# Altium project Float24.PrjPcb
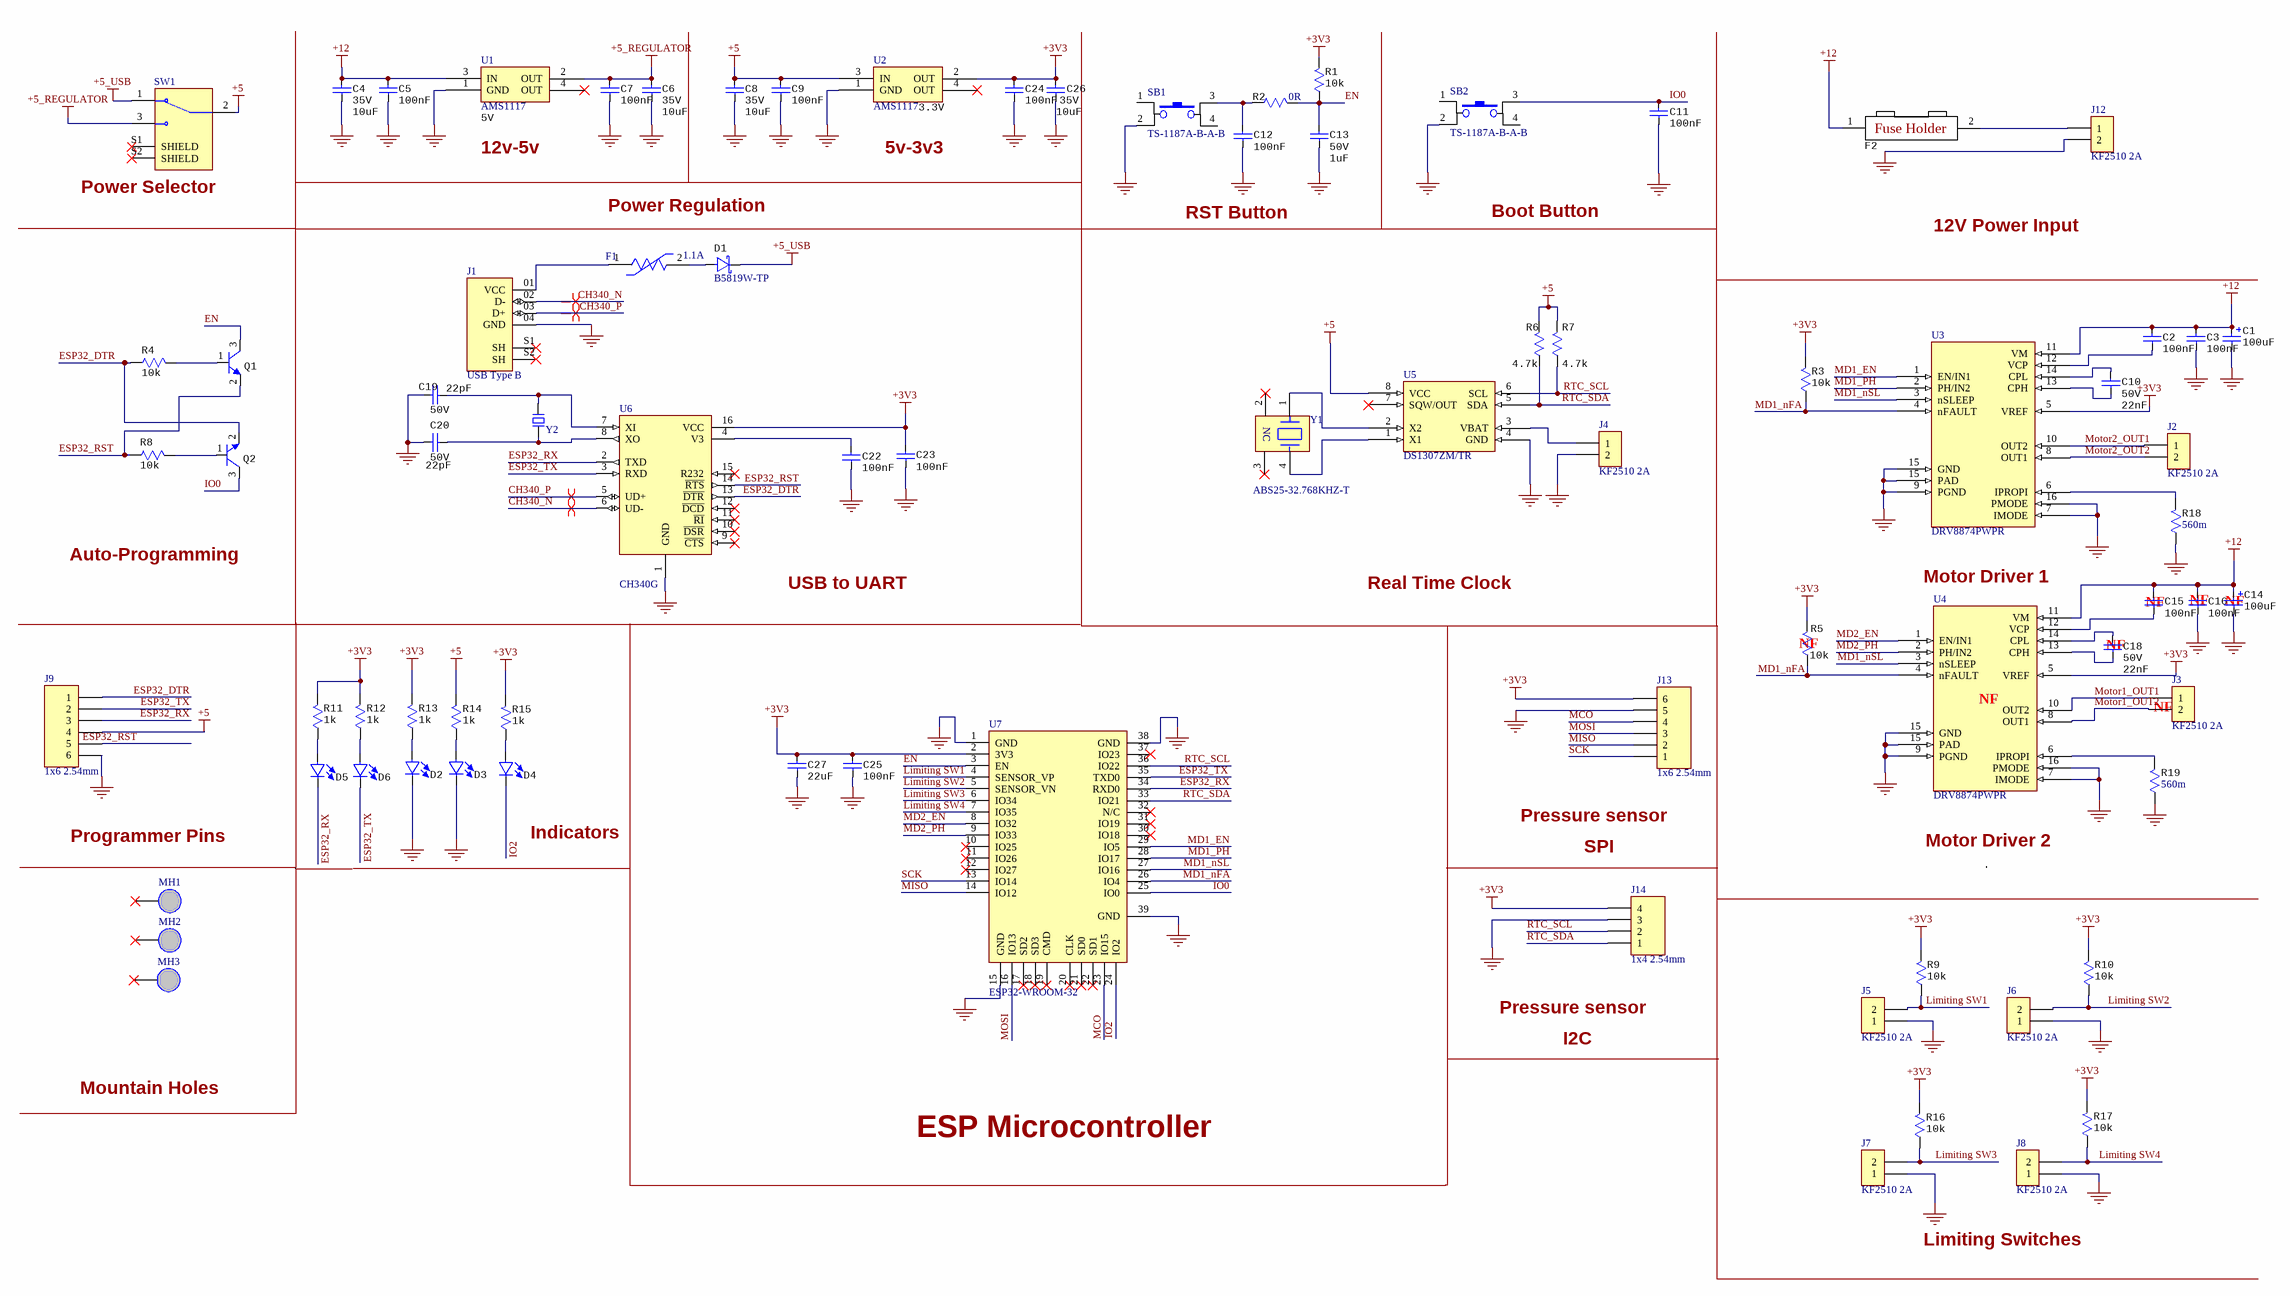
[diagram p0: Float24.SchDoc]
Title: Float24
1 sheet, 81 parts. Net scope: global (net labels, ports and power ports of the same name join across sheets).
Board file: Float24.PcbDoc

## Sheet Float24.SchDoc: Float24
size C; SheetNumber: 1; SheetTotal: 1

### Parts
C1  100uF  [CAP Electrolytic SMD G_10X10.3X10.2(CPOL-EU153CLV-1010)]
C2  100nF  [CAP Ceramic SMD 0603]
C3  100nF  [CAP Ceramic SMD 0603]
C4  Voltage: 35V  [CAP Ceramic SMD 0603]  (hidden comment: 10uF)
C5  100nF  [CAP Ceramic SMD 0603]
C6  Voltage: 35V  [CAP Ceramic SMD 0603]  (hidden comment: 10uF)
C7  100nF  [CAP Ceramic SMD 0603]
C8  Voltage: 35V  [CAP Ceramic SMD 0603]  (hidden comment: 10uF)
C9  100nF  [CAP Ceramic SMD 0603]
C10  Voltage: 50V  [CAP Ceramic SMD 0603]  (hidden comment: 22nF)
C11  100nF  [CAP Ceramic SMD 0603]
C12  100nF  [CAP Ceramic SMD 0603]
C13  Voltage: 50V  [CAP Ceramic SMD 0603]  (hidden comment: 1uF)
C14  100uF  [CAP Electrolytic SMD G_10X10.3X10.2(CPOL-EU153CLV-1010)]
C15  100nF  [CAP Ceramic SMD 0603]
C16  100nF  [CAP Ceramic SMD 0603]
C18  Voltage: 50V  [CAP Ceramic SMD 0603]  (hidden comment: 22nF)
C19  Voltage: 50V  [CAP Ceramic SMD 0603]  (hidden comment: 22pF)
C20  Voltage: 50V  [CAP Ceramic SMD 0603]  (hidden comment: 22pF)
C22  100nF  [CAP Ceramic SMD 0603]
C23  100nF  [CAP Ceramic SMD 0603]
C24  100nF  [CAP Ceramic SMD 0603]
C25  100nF  [CAP Ceramic SMD 0603]
C26  Voltage: 35V  [CAP Ceramic SMD 0603]  (hidden comment: 10uF)
C27  22uF  [CAP Ceramic SMD 0603]
D1  Manufacturer Part Number: B5819W-TP  [Diode Single SMD SOD123]
D2  (no value)  [LED SMD 0805G]
D3  (no value)  [LED SMD 0805G]
D4  (no value)  [LED SMD 0805R]
D5  (no value)  [LED SMD 0805B]
D6  (no value)  [LED SMD 0805B]
F1  Hold Current: 1.1A  [FUSE-1206]  (hidden comment: 1206L110THYR)
F2  XF-508P-A  [FUSE-TH_L19.8-W7.0_XF-508P-A]  (value not drawn)
J1  USB Type B  [USB_B_Vertical]
J2  KF2510 2A  [Connector MOLEX KK-254 KF2510-2]
J3  KF2510 2A  [Connector MOLEX KK-254 KF2510-2]
J4  KF2510 2A  [Connector MOLEX KK-254 KF2510-2]
J5  KF2510 2A  [Connector MOLEX KK-254 KF2510-2]
J6  KF2510 2A  [Connector MOLEX KK-254 KF2510-2]
J7  KF2510 2A  [Connector MOLEX KK-254 KF2510-2]
J8  KF2510 2A  [Connector MOLEX KK-254 KF2510-2]
J9  1x6 2.54mm  [Header F 2.54X6]
J12  KF2510 2A  [Connector MOLEX KK-254 KF2510-2]
J13  1x6 2.54mm  [Header F 2.54X6]
J14  1x4 2.54mm  [Header F 2.54X4]
MH1  Mounting Hole 4mm  [Connector Mounting hole TH 4mm]  (value not drawn)  (no BOM)
MH2  Mounting Hole 4mm  [Connector Mounting hole TH 4mm]  (value not drawn)  (no BOM)
MH3  Mounting Hole 4mm  [Connector Mounting hole TH 4mm]  (value not drawn)  (no BOM)
Q1  (no value)  [SOT23]
Q2  (no value)  [SOT23]
R1  value 10k  [RES SMD 0603]  (hidden comment: 10kR)
R2  0R  [RES SMD 0603]
R3  value 10k  [RES SMD 0603]  (hidden comment: 10kR)
R4  value 10k  [RES SMD 0603]  (hidden comment: 10kR)
R5  value 10k  [RES SMD 0603]  (hidden comment: 10kR)
R6  value 4.7k  [RES SMD 0603]  (hidden comment: 4.7kR)
R7  value 4.7k  [RES SMD 0603]  (hidden comment: 4.7kR)
R8  value 10k  [RES SMD 0603]  (hidden comment: 10kR)
R9  value 10k  [RES SMD 0603]  (hidden comment: 10kR)
R10  value 10k  [RES SMD 0603]  (hidden comment: 10kR)
R11  value 1k  [RES SMD 0603]  (hidden comment: 1kR)
R12  value 1k  [RES SMD 0603]  (hidden comment: 1kR)
R13  value 1k  [RES SMD 0603]  (hidden comment: 1kR)
R14  value 1k  [RES SMD 0603]  (hidden comment: 1kR)
R15  value 1k  [RES SMD 0603]  (hidden comment: 1kR)
R16  value 10k  [RES SMD 0603]  (hidden comment: 10kR)
R17  value 10k  [RES SMD 0603]  (hidden comment: 10kR)
R18  560m  [RES SMD 0603]
R19  560m  [RES SMD 0603]
SB1  TS-1187A-B-A-B  [SW-SMD-4X4X1.5]
SB2  TS-1187A-B-A-B  [SW-SMD-4X4X1.5]
SW1  (no value)  [SS12 Slide Switch]
U1  AMS1117  Voltage output: 5V  [Linear reagulator SMD AMS1117 - duplicate]
U2  AMS1117  Voltage output: 3.3V  [Linear reagulator SMD AMS1117 - duplicate]
U3  DRV8874PWPR  [DRV8874PWPR]
U4  DRV8874PWPR  [DRV8874PWPR]
U5  DS1307ZM/TR  [SOP-8]
U6  CH340G  [SOIC127P600X180-16N]
U7  ESP32-WROOM-32  [ESP32-WROOM-32D]
Y1  ABS25-32.768KHZ-T  [Crystal SMD 4-PIN MC-306]
Y2  X49SD12MSD2SC  [Crystal TH 2-PIN HC-49S]  (value not drawn)

### Nets
+3V3: C23.1 C24.1 C25.1 C26.1 C27.1 J13.6 J14.4 R1.2 R3.2 R5.2 R9.2 R10.2 R11.2 R12.2 R13.2 R15.2 R16.2 R17.2 U2.2(OUT) U3.5(VREF) U4.5(VREF) U6.16(VCC) U7.2(3V3)
+5: C8.1 C9.1 J9.4 R6.2 R7.2 R14.2 SW1.2(COM_2) U2.3(IN) U5.8(VCC)
+5_REGULATOR: C6.1 C7.1 SW1.3 U1.2(OUT)
+5_USB: D1.2 SW1.1
+12: C1.1 C2.1 C3.1 C4.1 C5.1 C14.1 C15.1 C16.1 F2.1 U1.3(IN) U3.11(VM) U4.11(VM)
GND: C1.2 C3.2 C4.2 C5.2 C6.2 C7.2 C8.2 C9.2 C11.2 C12.2 C13.2 C14.2 C16.2 C19.1 C20.1 C22.2 C23.2 C24.2 C25.2 C26.2 C27.2 D2.2 D3.2 J1.04(GND) J4.2 J5.1 J6.1 J7.1 J8.1 J9.6 J12.2 J13.5 J14.3 R18.1 R19.1 SB1.2 SB2.2 U1.1(GND) U2.1(GND) U3.7(IMODE) U3.9(PGND) U3.15(GND) U3.16(PMODE) U4.7(IMODE) U4.9(PGND) U4.15(GND) U4.16(PMODE) U5.4(GND) U6.1(GND) U7.1(GND) U7.15(GND) U7.38(GND) U7.39(GND)
CH340_N: J1.02(D-) U6.6(UD-)
CH340_P: J1.03(D+) U6.5(UD+)
EN: C13.1 Q1.3(C) R1.1 R2.2 U7.3(EN)
ESP32_DTR: J9.1 Q2.2(E) R4.1 U6.13(~{DTR})
ESP32_RST: J9.5 Q1.2(E) R8.1 U6.14(~{RTS})
ESP32_RX: D5.2 J9.3 U6.2(TXD) U7.34(RXD0)
ESP32_TX: D6.2 J9.2 U6.3(RXD) U7.35(TXD0)
IO0: C11.1 Q2.3(C) SB2.3 U7.25(IO0)
IO2: D4.2 U7.24(IO2)
Limiting SW1: J5.2 R9.1 U7.4(SENSOR_VP)
Limiting SW2: J6.2 R10.1 U7.5(SENSOR_VN)
Limiting SW3: J7.2 R16.1 U7.6(IO34)
Limiting SW4: J8.2 R17.1 U7.7(IO35)
MCO: J13.4 U7.23(IO15)
MD1_EN: U3.1(EN/IN1) U7.29(IO5)
MD1_nFA: R3.1 R5.1 U3.4(nFAULT) U4.4(nFAULT) U7.26(IO4)
MD1_nSL: U3.3(nSLEEP) U4.3(nSLEEP) U7.27(IO16)
MD1_PH: U3.2(PH/IN2) U7.28(IO17)
MD2_EN: U4.1(EN/IN1) U7.8(IO32)
MD2_PH: U4.2(PH/IN2) U7.9(IO33)
MISO: J13.2 U7.14(IO12)
MOSI: J13.3 U7.16(IO13)
Motor1_OUT1: J3.1 U4.10(OUT2)
Motor1_OUT2: J3.2 U4.8(OUT1)
Motor2_OUT1: J2.1 U3.10(OUT2)
Motor2_OUT2: J2.2 U3.8(OUT1)
RTC_SCL: J14.2 R7.1 U5.6(SCL) U7.36(IO22)
RTC_SDA: J14.1 R6.1 U5.5(SDA) U7.33(IO21)
SCK: J13.1 U7.13(IO14)
NetC2_2: C2.2 U3.12(VCP)
NetC10_1: C10.1 U3.14(CPL)
NetC10_2: C10.2 U3.13(CPH)
NetC12_1: C12.1 R2.1 SB1.3
NetC15_2: C15.2 U4.12(VCP)
NetC18_1: C18.1 U4.14(CPL)
NetC18_2: C18.2 U4.13(CPH)
NetC19_2: C19.2 U6.7(XI) Y2.1
NetC20_2: C20.2 U6.8(XO) Y2.2
NetC22_1: C22.1 U6.4(V3)
NetD1_1: D1.1 F1.2
NetD2_1: D2.1 R13.1
NetD3_1: D3.1 R14.1
NetD4_1: D4.1 R15.1
NetD5_1: D5.1 R11.1
NetD6_1: D6.1 R12.1
NetF1_1: F1.1 J1.01(VCC)
NetF2_2: F2.2 J12.1
NetJ4_1: J4.1 U5.3(VBAT)
NetQ1_1: Q1.1(B) R4.2
NetQ2_1: Q2.1(B) R8.2
NetR18_2: R18.2 U3.6(IPROPI)
NetR19_2: R19.2 U4.6(IPROPI)
NetU5_1: U5.1(X1) Y1.4
NetU5_2: U5.2(X2) Y1.1

Not connected (* = marked no-connect by the designer): J1 S1(SH)* S2(SH)*; MH1 1*; MH2 1*; MH3 1*; SB1 1 4; SB2 1 4; SW1 S1(SHIELD)* S2(SHIELD)*; U1 4(OUT)*; U2 4(OUT)*; U5 7(SQW/OUT)*; U6 9(~{CTS})* 10(~{DSR})* 11(~{RI})* 12(~{DCD})* 15(R232)*; U7 10(IO25)* 11(IO26)* 12(IO27)* 17(SD2)* 18(SD3)* 19(CMD)* 20(CLK)* 21(SD0)* 22(SD1)* 30(IO18)* 31(IO19)* 32(N/C)* 37(IO23)*; Y1 2(NC)* 3(NC)*

### Layout directives
differential pair: CH340_N, CH340_P

### Notes on the sheet
- (near SW1) Power Selector
- 12v-5v
- 5v-3v3
- Power Regulation
- RST Button
- Boot Button
- 12V Power Input
- Auto-Programming
- USB to UART
- Real Time Clock
- (near U4) Motor Driver 1
- (near R5) NF
- (near C18) NF
- (near C15) NF
- (near C16) NF
- (near C14) NF
- (near U4) NF
- (near J3) NF
- Pressure sensor
- Programmer Pins
- Indicators
- SPI
- Motor Driver 2
- I2C
- Mountain Holes
- ESP Microcontroller
- Limiting Switches
- (in symbol Fuse Automotive holder) Fuse Holder

### Library data of the parts
C1 C14 = CAP ELEC 100uF 68V: -40℃~+105℃ 2000hrs@105℃ 100uF 10.2mm 63V 10mm ±20% SMD,D10xL10.2mm Aluminum Electrolytic Capacitors - SMD ROHS; Manufacturer: ROQANG; Manufacturer Part Number: RT1J101M1010; ComponentLink1Description: Datasheet; ComponentLink1URL: https://datasheet.lcsc.com/lcsc/1809061214_Nichicon-UWX1C101MCL1GB_C111600.pdf; Supplier: LCSC; Supplier Part Number: C280414; Capacitance: 100uF
C2 C3 C5 C7 C9 C11 C12 C15 C16 C22-C25 = CAP 0603 100nF 100V: 0603 0.1 uF 100 V ±10% Tolerance X7R Multilayer Ceramic Capacitor; Manufacturer: Yageo; Manufacturer Part Number: AC0603KRX7R0BB104; Voltage Rating: 100V; Supplier: LCSC; Supplier Part Number: C408909; RoHS: Yes; Category: Ceramic Capacitors; Stock 1: 6927977; Pricing 1: 1=0.17000, 10=0.11900, 50=0.06760, 100=0.05590, 500=0.03922, 1000=0.03246 (USD); Mount: Surface Mount; Case/Package: 0603; Case Code (Metric): 1608; Case Code (Imperial): 0603; Weight: 7.1E-05oz; Min Operating Temperature: -55°C; Max Operating Temperature: 125°C; Package Quantity: 4000; Capacitance: 100nF; Tolerance: 10%; Packaging: Tape and Reel; Dielectric: X7R; Termination: SMD/SMT; Resistor Type: Ceramic; Voltage Rating (DC): 100V; Series: CC; Length: 0.063inch; Width: 0.031inch; Thickness: 0.035inch; Depth: 0.8mm; Lead Free: Lead Free; RoHS Compliant: Yes; ComponentLink1URL: https://datasheet.ciiva.com/6277/mlccorderingcode-6277082.pdf?src-supplier=Digi-Key; ComponentLink1Description: https://datasheet.ciiva.com/6277/mlccorderingcode-6277082.pdf?src-supplier=Digi-Key; ComponentLink2URL: https://datasheet.ciiva.com/6277/mlccorderingcode-6277081.pdf?src-supplier=Digi-Key; ComponentLink2Description: https://datasheet.ciiva.com/6277/mlccorderingcode-6277081.pdf?src-supplier=Digi-Key; ComponentLink3URL: https://datasheet.ciiva.com/6277/mlccorderingcode-6277030.pdf?src-supplier=Digi-Key; ComponentLink3Description: https://datasheet.ciiva.com/6277/mlccorderingcode-6277030.pdf?src-supplier=Digi-Key
C4 C6 C8 C26 = CAP 0603 10uF 35V: Cap Ceramic 10uF 35V X5R 20% Pad SMD 0603 85C T/R; Manufacturer: Murata; Manufacturer Part Number: GRM188R6YA106MA73D; Supplier 1: LCSC; RoHS: Yes; Category: Ceramic Capacitors; Mount: Surface Mount; Case/Package: 0603; Case Code (Metric): 1608; Case Code (Imperial): 0603; Min Operating Temperature: -55°C; Max Operating Temperature: 85°C; Packaging: Tape and Reel; Capacitance: 10uF; Voltage Rating: 35V; Tolerance: 20%; Dielectric: X5R; Voltage Rating (DC): 35V; Length: 0.063inch; Width: 0.031inch; Thickness: 0.039inch; RoHS Compliant: Yes; ComponentLink1URL: http://search.murata.co.jp/Ceramy/image/img/A01X/G101/ENG/GRM188R6YA106MA73-01.pdf?src-supplier=Future+Electronics; ComponentLink1Description: http://search.murata.co.jp/Ceramy/image/img/A01X/G101/ENG/GRM188R6YA106MA73-01.pdf?src-supplier=Future+Electronics; ComponentLink2URL: http://search.murata.co.jp/Ceramy/image/img/A01X/G101/ENG/GRM188R6YA106MA73-01.pdf?src-supplier=Digi-Key; ComponentLink2Description: http://search.murata.co.jp/Ceramy/image/img/A01X/G101/ENG/GRM188R6YA106MA73-01.pdf?src-supplier=Digi-Key; ComponentLink3URL: https://www.murata.com/~/media/webrenewal/support/library/catalog/products/capacitor/mlcc/c02e.ashx?la=en-us&src-supplier=Digi-Key; ComponentLink3Description: https://www.murata.com/~/media/webrenewal/support/library/catalog/products/capacitor/mlcc/c02e.ashx?la=en-us&src-supplier=Digi-Key; ComponentLink4URL: http://search.murata.co.jp/Ceramy/image/img/A01X/G101/ENG/GRM188R6YA106MA73-01.pdf?src-supplier=Mouser; ComponentLink4Description: http://search.murata.co.jp/Ceramy/image/img/A01X/G101/ENG/GRM188R6YA106MA73-01.pdf?src-supplier=Mouser; ComponentLink5URL: http://search.murata.co.jp/Ceramy/image/img/A01X/G101/ENG/GRM188R6YA106MA73-01.pdf?src-supplier=TTI; ComponentLink5Description: http://search.murata.co.jp/Ceramy/image/img/A01X/G101/ENG/GRM188R6YA106MA73-01.pdf?src-supplier=TTI; Supplier Part Number 1: C194427; Value: 10uF
C10 C18 = CAP 0603 22nF 50V: Ceramic capacitor SMD-0603 22nF /50V X7R# K +-10%, Samsung, RoHS; Manufacturer Part Number: CL10B223KB8NNNC; Tolerance: 10%; Dielectric: X7R; Supplier 1: LCSC; Supplier Part Number 1: C21122; Manufacturer: Samsung; RoHS: Yes; Category: Ceramic Capacitors; Stock 1: 380900; Pricing 1: 100=0.00480, 1000=0.00400, 4000=0.00360, 8000=0.00330, 48000=0.00310, 100000=0.00300 (USD); Mount: Surface Mount; Case/Package: 0603; Case Code (Metric): 1608; Case Code (Imperial): 0603; Contact Plating: Tin; Material: Ceramic; Min Operating Temperature: -55°C; Max Operating Temperature: 125°C; Voltage Rating (DC): 50V; Package Quantity: 1; Packaging: Tape and Reel; Voltage Rating: 50V; Series: CL; Construction: Flat; Length: 1.6mm; Width: 0.031inch; Height: 0.8mm; Thickness: 0.035inch; Depth: 0.8mm; Radiation Hardening: No; Lead Free: Lead Free; RoHS Compliant: Yes; ComponentLink1URL: https://datasheet.ciiva.com/25802/cl10b223kb8nnnc-25802289.pdf?src-supplier=Digi-Key; ComponentLink1Description: https://datasheet.ciiva.com/25802/cl10b223kb8nnnc-25802289.pdf?src-supplier=Digi-Key; ComponentLink2URL: https://datasheet.ciiva.com/26838/getdatasheetpartid-357419-26838449.pdf?src-supplier=Verical; ComponentLink2Description: https://datasheet.ciiva.com/26838/getdatasheetpartid-357419-26838449.pdf?src-supplier=Verical; ComponentLink3URL: https://datasheet.ciiva.com/29198/457190-da-01-en-vs-kondensator-0603-29198760.pdf?src-supplier=Conrad; ComponentLink3Description: https://datasheet.ciiva.com/29198/457190-da-01-en-vs-kondensator-0603-29198760.pdf?src-supplier=Conrad; ComponentLink4URL: https://datasheet.ciiva.com/26310/mlcc-catalogdownload2013-eng-26310316.pdf?src-supplier=Distrelec; ComponentLink4Description: https://datasheet.ciiva.com/26310/mlcc-catalogdownload2013-eng-26310316.pdf?src-supplier=Distrelec; ComponentLink5URL: https://datasheet.ciiva.com/16318/cl05b104kq5nnnc-16318246.pdf?src-supplier=Future+Electronics; ComponentLink5Description: https://datasheet.ciiva.com/16318/cl05b104kq5nnnc-16318246.pdf?src-supplier=Future+Electronics; Capacitance: 22nF
C13 = CAP 0603 1uF 50V: 0603 1 uF 50 V ±10% Tolerance X5R SMT Multilayer Ceramic Capacitor; Manufacturer: Murata; Manufacturer Part Number: GRM188R61H105KAALD; Dielectric: X7R; RoHS: Yes; Category: Ceramic Capacitors; Stock 1: 2200; Pricing 1: 50=0.01970, 500=0.01600, 1500=0.01390, 5000=0.01050, 25000=0.00960, 50000=0.00910 (USD); Mount: Surface Mount; Case/Package: 0603; Case Code (Metric): 1608; Case Code (Imperial): 0603; Weight: 0.000222oz; Material: Ceramic; Min Operating Temperature: -55°C; Max Operating Temperature: 85°C; Capacitance: 1uF; Tolerance: 10%; Voltage Rating: 50V; Packaging: Tape and Reel; Voltage Rating (DC): 50V; Package Quantity: 4000; Termination: SMD/SMT; Series: GRM; Resistor Type: Ceramic; Construction: Flat; Length: 1.6mm; Width: 0.8mm; Height: 0.8mm; Thickness: 0.035inch; Depth: 0.8mm; Radiation Hardening: No; RoHS Compliant: Yes; Lead Free: Lead Free; REACH SVHC: No SVHC; ComponentLink1URL: https://datasheet.ciiva.com/23628/1522414-23628576.pdf?src-supplier=Newark; ComponentLink1Description: https://datasheet.ciiva.com/23628/1522414-23628576.pdf?src-supplier=Newark; ComponentLink2URL: https://datasheet.ciiva.com/22706/1747450-22706788.pdf?src-supplier=Element14; ComponentLink2Description: https://datasheet.ciiva.com/22706/1747450-22706788.pdf?src-supplier=Element14; ComponentLink3URL: https://datasheet.ciiva.com/14116/grmseries-highdielectrictype-eng-14116381.pdf?src-supplier=Distrelec; ComponentLink3Description: https://datasheet.ciiva.com/14116/grmseries-highdielectrictype-eng-14116381.pdf?src-supplier=Distrelec; ComponentLink4URL: https://datasheet.ciiva.com/7719/1747450-7719046.pdf?src-supplier=Element14; ComponentLink4Description: https://datasheet.ciiva.com/7719/1747450-7719046.pdf?src-supplier=Element14; Value: 1uF; Supplier 1: LCSC; Supplier Part Number 1: C77386
C19 C20 = CAP 0603 22pF 50V: CAP CER 22PF 50V C0G/NP0 0603; Manufacturer: Samsung; Manufacturer Part Number: CL10C220JB81PNC; Tolerance: 5%; Dielectric: C0G; Temperature Coefficient: 300ppm/°C; ComponentLink1URL: https://datasheet.ciiva.com/6293/tdkmlcccaprange-6293701.pdf?src-supplier=Digi-Key; ComponentLink1Description: https://datasheet.ciiva.com/6293/tdkmlcccaprange-6293701.pdf?src-supplier=Digi-Key; ComponentLink2URL: https://datasheet.ciiva.com/22694/1796654-22694102.pdf?src-supplier=Element14; ComponentLink2Description: https://datasheet.ciiva.com/22694/1796654-22694102.pdf?src-supplier=Element14; ComponentLink3URL: https://datasheet.ciiva.com/6293/tdkmlcccaprange-6293704.pdf?src-supplier=Digi-Key; ComponentLink3Description: https://datasheet.ciiva.com/6293/tdkmlcccaprange-6293704.pdf?src-supplier=Digi-Key; ComponentLink4URL: https://datasheet.ciiva.com/28576/1744655-28576921.pdf?src-supplier=Element14; ComponentLink4Description: https://datasheet.ciiva.com/28576/1744655-28576921.pdf?src-supplier=Element14; ComponentLink5URL: https://datasheet.ciiva.com/7975/1796654-7975034.pdf?src-supplier=Element14; ComponentLink5Description: https://datasheet.ciiva.com/7975/1796654-7975034.pdf?src-supplier=Element14; ComponentLink6URL: https://datasheet.ciiva.com/26946/getdatasheetpartid-741952-26946507.pdf?src-supplier=Verical; ComponentLink6Description: https://datasheet.ciiva.com/26946/getdatasheetpartid-741952-26946507.pdf?src-supplier=Verical; ComponentLink7URL: https://datasheet.ciiva.com/6293/tdkmlcccaprange-6293708.pdf?src-supplier=Digi-Key; ComponentLink7Description: https://datasheet.ciiva.com/6293/tdkmlcccaprange-6293708.pdf?src-supplier=Digi-Key; ComponentLink8URL: https://datasheet.ciiva.com/16395/cl10c220jb81pnc-16395896.pdf?src-supplier=Future+Electronics; ComponentLink8Description: https://datasheet.ciiva.com/16395/cl10c220jb81pnc-16395896.pdf?src-supplier=Future+Electronics; ComponentLink9URL: https://datasheet.ciiva.com/15195/getdatasheetpartid-500209-15195809.pdf?src-supplier=Verical; ComponentLink9Description: https://datasheet.ciiva.com/15195/getdatasheetpartid-500209-15195809.pdf?src-supplier=Verical; Supplier 1: LCSC; RoHS: Yes; Category: Ceramic Capacitors; Stock 1: 8800; Pricing 1: 50=0.02060, 500=0.01690, 1500=0.01410, 5000=0.01190, 25000=0.01150, 50000=0.01130 (USD); Mount: Surface Mount; Case/Package: 0603; Case Code (Metric): 1608; Case Code (Imperial): 0603; Min Operating Temperature: -55°C; Max Operating Temperature: 125°C; Package Quantity: 1; Packaging: Tape and Reel; Capacitance: 22pF; Voltage Rating: 50V; Series: CL; Length: 1.6mm; Width: 0.031inch; Height: 0.8mm; Depth: 0.8mm; Thickness: 0.035inch; Ratings: AEC-Q200; Radiation Hardening: No; RoHS Compliant: Yes; Lead Free: Lead Free; Supplier Part Number 1: C170132; Supplier 2: LCSC; Supplier Part Number 2: C1653; Value: 22pF
C27 = CAP 0603 22uF 16V: 16V 22uF 0603 Multilayer Ceramic Capacitors MLCC - SMD/SMT ROHS; Manufacturer Part Number: C0603X5R226M160NT; Manufacturer: SANYEAR; Supplier Part Number: C2835567; Supplier: LCSC; Mount: Surface Mount; Voltage: 16V; Capacitance: 22uF
D1 = B5819W: 40V 600mV@1A 1A SOD-123 Schottky Barrier Diodes (SBD) ROHS; Manufacturer: MCC; Element Configuration: Single; Forward Voltage: 550mV; Max Reverse Voltage (DC): 20V; Max Forward Surge Current (Ifsm): 10A; Max Reverse Current: 1mA; Max Power Dissipation: 250mW; Supplier 1: LCSC; RoHS: Yes; Category: Rectifier Diodes; Stock 1: 8570; Pricing 1: 10=0.04150, 100=0.03440, 300=0.03090, 3000=0.02820, 6000=0.02610, 9000=0.02500 (USD); Mount: Surface Mount; Min Operating Temperature: -65°C; Max Operating Temperature: 125°C; Package Quantity: 3000; Packaging: Tape and Reel; Average Rectified Current: 1A; Series: -; Reverse Voltage (DC): 40V; Forward Current: 1A; Max Repetitive Reverse Voltage (Vrrm): 40V; RoHS Compliant: Yes; ComponentLink1URL: https://datasheet.ciiva.com/6378/b5817w-b5819wsod-123-6378255.pdf?src-supplier=Digi-Key; ComponentLink1Description: https://datasheet.ciiva.com/6378/b5817w-b5819wsod-123-6378255.pdf?src-supplier=Digi-Key; Supplier Part Number 1: C84354
D2 D3 = LED 0805 Emerald: emerald 0805 Light Emitting Diodes (LED) ROHS; Manufacturer: FOSHAN Nationstar Optoelectronics; Manufacturer Part Number: NCD0805G1; Supplier: LCSC; Supplier Part Number: C84260; RoHS: No; Category: Uncategorized; Stock 1: 432460; Pricing 1: 20=0.01910, 200=0.01510, 600=0.01290, 3000=0.01160, 9000=0.01050, 21000=0.00990 (USD)
D4 = LED 0805 Red: red 0805 Light Emitting Diodes (LED) ROHS; Manufacturer: FOSHAN Nationstar Optoelectronics; Manufacturer Part Number: NCD0805R1; Supplier: LCSC; Supplier Part Number: C84256; RoHS: No; Category: Uncategorized; Stock 1: 1189900; Pricing 1: 50=0.01160, 500=0.00900, 3000=0.00780, 6000=0.00700, 24000=0.00660, 51000=0.00640 (USD)
D5 D6 = LED 0805 Blue: blue 0805 Light Emitting Diodes (LED) ROHS; Manufacturer: FOSHAN Nationstar Optoelectronics; Manufacturer Part Number: NCD0805B2; Supplier: LCSC; Supplier Part Number: C84259; RoHS: No; Category: Uncategorized; Stock 1: 103180; Pricing 1: 20=0.02090, 200=0.01660, 600=0.01420, 3000=0.01280, 9000=0.01150, 21000=0.01090 (USD)
F1 = 1206L110THYR: PTC RESET FUSE 8V 1.1A 1206; Manufacturer: Littelfuse; Trip Time: 0.1s; Trip Current: 2.2A; Value: 0.04-0.21Ω; Current Rating: 100A; Voltage Rating: 8V; Device Class L3: unset; Manufacturer Part Number: 1206L110THYR; ComponentLink2URL: https://m.littelfuse.com/~/media/electronics/datasheets/resettable_ptcs/littelfuse_ptc_1206l_datasheet.pdf.pdf; Height: 0.6mm; Temperature Range Low: -40°C; Automotive: No; Device Class L2: PTC Resettable Fuses; Device Class L1: Circuit Protection; Digikey Description: PTC RESET FUSE 8V 1.1A 1206; Octopart: https://octopart.com/1206l110thyr-littelfuse-11800142; Temperature Range High: +85°C; Category: Fuse; RoHS: TRUE; Ambient Temperature Range Low: -40°C; Mouser Description: Resettable Fuses - PPTC PTC 8V 1206 1.1A POLYFUSE SMD THIN; ComponentLink2Description: Datasheet; Ambient Temperature Range High: +85°C; Lead Free: Yes; Resistance: 0.04-0.21Ω; Temperature: -40°C to +85°C; Package: 1206L
F2 = Fuse Automotive holder: Plugin Fuse Holders ROHS; Manufacturer: XFCN; Package: Plugin; Supplier: LCSC; Manufacturer Part Number: XF-508P-A; Supplier Part Number: C2935469
J1 = USB Type B: Manufacturer Part Number: 921-111A1010Y10200; Manufacturer: Jing Extension of the Electronic Co.; Supplier: LCSC; Supplier Part Number: C26234
J2-J8 J12 = KF2510 2A: 1x2P 1 2.54mm Male pin 2 -25℃~+85℃ 3A Straight Plugin,P=2.54mm Wire To Board / Wire To Wire Connector ROHS; Manufacturer: CAX; ManufacturerPartNumber: 2510-2A; Supplier: LCSC; SupplierPartNumber: C722716
J9 J13 = Connector Pinsocket 1x6_1: Plugin,P=2.54mm Female Headers ROHS; Manufacturer: CONNYFLY Elec; Mfr. Part #: DS1023-1x6SF11; Supplier: LCSC; Supplier Part #: C7509518
J14 = Connector Pinsocket 1x4: Plugin,P=2.54mm Female Headers ROHS; Manufacturer: CONNYFLY Elec; Mfr. Part #: DS1023-1x4SF11; Supplier: LCSC; Supplier Part #: C7509546
Q1 Q2 = BC817: NPN Ic=500mA Vceo=45V hfe=100~250 P=225mW SOT-23; Manufacturer: ON Semiconductor; Manufacturer Part Number: BC817-16LT1G; Collector Emitter Voltage (VCEO): 45V; Max Power Dissipation: 300mW; Max Collector Current: 500mA; Collector Base Voltage (VCBO): 50V; Emitter Base Voltage (VEBO): 5V; Collector Emitter Saturation Voltage: 700mV; Max Frequency: 100MHz; Element Configuration: Single; Number of Elements: 1; hFE Min: 100; Output Voltage: 15V; Supplier 1: LCSC; RoHS: Yes; Category: BJTs; Stock 1: 1880; Pricing 1: 10=0.03790, 100=0.03090, 300=0.02740, 3000=0.02460, 6000=0.02250, 9000=0.02140 (USD); Case/Package: SOT-23-3; Number of Pins: 3; Contact Plating: Tin,Matte; Weight: 0.001058oz; Min Operating Temperature: -55°C; Max Operating Temperature: 150°C; Packaging: Tape and Reel; Polarity: NPN; Power Dissipation: 300mW; Package Quantity: 3000; Frequency: 100MHz; Transition Frequency: 100MHz; Collector Emitter Breakdown Voltage: 45V; Max Breakdown Voltage: 45V; Gain Bandwidth Product: 100MHz; Collector-emitter Voltage-Max: 700mV; Series: -; Current Rating: 500mA; Voltage Rating (DC): 45V; Continuous Collector Current: 500mA; Length: 2.9mm; Width: 1.3mm; Height: 0.94mm; Radiation Hardening: No; RoHS Compliant: Yes; Lead Free: Lead Free; Reach SVHC Compliant: Yes; Halogen Free: Halogen Free; Supplier Part Number 1: C94373
R1 R3-R5 R8-R10 R16 R17 = RES 0603 10k 1%: Res Thick Film 0603 10K Ohm 1% 1/10W ±100ppm/°C Molded SMD Punched Carrier T/R; Manufacturer: Panasonic; Manufacturer Part Number: ERJ-3EKF1002V; Max Power Dissipation: 100mW; Voltage Rating: 75V; RoHS: Yes; Category: Chip SMD Resistors; Mount: Surface Mount; Case/Package: 0603; Number of Pins: 2; Case Code (Metric): 1608; Case Code (Imperial): 0603; Contact Plating: Tin; Size Code: 0603; Min Operating Temperature: -55°C; Max Operating Temperature: 155°C; Resistance: 10kR; Packaging: Tape and Reel; Resistor Type: Thick Film; Temperature Coefficient: 100ppm/°C; Tolerance: 1%; Number of Terminations: 2; Series: ERJ; Construction: Rectangular; Power Rating: 100mW; Features: Automotive AEC-Q200; Voltage Rating (DC): 75V; Package Quantity: 1; Resistance Tolerance: 1%; Termination: SMD/SMT; Technology: THICK FILM; Length: 1.6mm; Width: 0.031inch; Height: 0.45mm; Depth: 0.8mm; Radiation Hardening: No; RoHS Compliant: Yes; Military Standard: Not; Lead Free: Lead Free; REACH SVHC: No SVHC; ComponentLink1URL: https://datasheet.ciiva.com/7830/aoa0000ce2-7830729.pdf?src-supplier=Element14; ComponentLink1Description: https://datasheet.ciiva.com/7830/aoa0000ce2-7830729.pdf?src-supplier=Element14; ComponentLink2URL: https://datasheet.ciiva.com/46372/1678782-46372725.pdf?src-supplier=Element14; ComponentLink2Description: https://datasheet.ciiva.com/46372/1678782-46372725.pdf?src-supplier=Element14; ComponentLink3URL: https://datasheet.ciiva.com/28514/426256-28514198.pdf?src-supplier=Element14; ComponentLink3Description: https://datasheet.ciiva.com/28514/426256-28514198.pdf?src-supplier=Element14; ComponentLink4URL: https://datasheet.ciiva.com/24070/aoa0000ce2-24070318.pdf?src-supplier=Mouser; ComponentLink4Description: https://datasheet.ciiva.com/24070/aoa0000ce2-24070318.pdf?src-supplier=Mouser; ComponentLink5URL: https://datasheet.ciiva.com/16759/70260748-16759807.pdf?src-supplier=Allied+Electronics; ComponentLink5Description: https://datasheet.ciiva.com/16759/70260748-16759807.pdf?src-supplier=Allied+Electronics; ComponentLink6URL: https://datasheet.ciiva.com/9194/aoa0000ce2-9194199.pdf?src-supplier=Avnet; ComponentLink6Description: https://datasheet.ciiva.com/9194/aoa0000ce2-9194199.pdf?src-supplier=Avnet; ComponentLink7URL: https://datasheet.ciiva.com/48530/aoa0000ce2-48530988.pdf?src-supplier=Avnet; ComponentLink7Description: https://datasheet.ciiva.com/48530/aoa0000ce2-48530988.pdf?src-supplier=Avnet; ComponentLink8URL: https://datasheet.ciiva.com/30208/aoa0000ce2-30208985.pdf?src-supplier=Onlinecomponents.com; ComponentLink8Description: https://datasheet.ciiva.com/30208/aoa0000ce2-30208985.pdf?src-supplier=Onlinecomponents.com; Supplier 1: LCSC; Stock 1: 555600; Pricing 1: 50=0.010200, 500=0.008400, 1500=0.007300, 5000=0.006100, 25000=0.005500, 50000=0.005400 (AUD); Supplier Part Number 1: C191124
R2 = RES 0603 0R 1%: ERJ Series 0603 0 Ohm 0.05 W Jumper Surface Mount Thick Film Chip Resistor; Manufacturer: Panasonic; Manufacturer Part Number: ERJ-3GEY0R00V; Tolerance: 1%; Max Power Dissipation: 100mW; Voltage Rating (DC): 50V; Temperature Coefficient: 600ppm/°C; Voltage Rating: 75V; RoHS: Yes; Category: Chip SMD Resistors; Mount: Surface Mount; Case/Package: 0603; Case Code (Metric): 1608; Case Code (Imperial): 0603; Contact Plating: Tin; Size Code: 0603; Min Operating Temperature: -55°C; Max Operating Temperature: 155°C; Packaging: Tape and Reel; Resistance: 0R; Resistor Type: Thick Film; Number of Terminations: 2; Series: ERJ; Power Rating: 100mW; Package Quantity: 1; Construction: Rectangular; Termination: SMD/SMT; Features: Automotive AEC-Q200; Technology: THICK FILM; Length: 1.6mm; Width: 0.031inch; Height: 0.45mm; Depth: 0.8mm; Radiation Hardening: No; RoHS Compliant: Yes; Lead Free: Lead Free; Military Standard: Not; REACH SVHC: No SVHC; ComponentLink1URL: https://datasheet.ciiva.com/27055/1935748-27055113.pdf?src-supplier=Jameco; ComponentLink1Description: https://datasheet.ciiva.com/27055/1935748-27055113.pdf?src-supplier=Jameco; ComponentLink2URL: https://datasheet.ciiva.com/11808/0900766b80f806dd-11808207.pdf?src-supplier=RSComponents; ComponentLink2Description: https://datasheet.ciiva.com/11808/0900766b80f806dd-11808207.pdf?src-supplier=RSComponents; ComponentLink3URL: https://datasheet.ciiva.com/48532/aoa0000ce1-48532165.pdf?src-supplier=Avnet; ComponentLink3Description: https://datasheet.ciiva.com/48532/aoa0000ce1-48532165.pdf?src-supplier=Avnet; ComponentLink4URL: https://datasheet.ciiva.com/43460/1678796-43460647.pdf?src-supplier=Farnell; ComponentLink4Description: https://datasheet.ciiva.com/43460/1678796-43460647.pdf?src-supplier=Farnell; ComponentLink5URL: https://datasheet.ciiva.com/28695/1678796-28695833.pdf?src-supplier=Element14; ComponentLink5Description: https://datasheet.ciiva.com/28695/1678796-28695833.pdf?src-supplier=Element14; ComponentLink6URL: https://datasheet.ciiva.com/5959/1678796-5959707.pdf?src-supplier=Farnell; ComponentLink6Description: https://datasheet.ciiva.com/5959/1678796-5959707.pdf?src-supplier=Farnell; ComponentLink7URL: https://datasheet.ciiva.com/16834/aoa0000ce1-16834828.pdf?src-supplier=Future+Electronics; ComponentLink7Description: https://datasheet.ciiva.com/16834/aoa0000ce1-16834828.pdf?src-supplier=Future+Electronics; ComponentLink8URL: https://datasheet.ciiva.com/46377/1678796-46377868.pdf?src-supplier=Element14; ComponentLink8Description: https://datasheet.ciiva.com/46377/1678796-46377868.pdf?src-supplier=Element14; ComponentLink9URL: https://datasheet.ciiva.com/30199/4aoa0000ce1-30199822.pdf?src-supplier=Onlinecomponents.com; ComponentLink9Description: https://datasheet.ciiva.com/30199/4aoa0000ce1-30199822.pdf?src-supplier=Onlinecomponents.com; ComponentLink10URL: https://datasheet.ciiva.com/9198/aoa0000ce1-9198975.pdf?src-supplier=Avnet; ComponentLink10Description: https://datasheet.ciiva.com/9198/aoa0000ce1-9198975.pdf?src-supplier=Avnet; ComponentLink11URL: https://datasheet.ciiva.com/16758/70255313-16758527.pdf?src-supplier=Allied+Electronics; ComponentLink11Description: https://datasheet.ciiva.com/16758/70255313-16758527.pdf?src-supplier=Allied+Electronics; ComponentLink12URL: https://datasheet.ciiva.com/22730/1678796-22730749.pdf?src-supplier=Element14; ComponentLink12Description: https://datasheet.ciiva.com/22730/1678796-22730749.pdf?src-supplier=Element14; Value: 0R; Supplier 1: Arrow Electronics; Stock 1: 3440000; Pricing 1: 5000=0.00480 (USD); Supplier Part Number 1: ERJ-3GEY0R00V; Supplier 2: LCSC; Stock 2: 79900; Pricing 2: 50=0.00820, 500=0.00670, 1500=0.00590, 5000=0.00540, 25000=0.00500, 50000=0.00480 (USD); Supplier Part Number 2: C716999
R6 R7 = RES 0603 4.7k 1%: Res Thin Film 0603 4.7K Ohm 0.1% 1/10W ±25ppm/°C Molded SMD SMD Punched Carrier T/R; Manufacturer: Panasonic; Manufacturer Part Number: ERA-3AEB472V; Max Power Dissipation: 100mW; Voltage Rating (DC): 75V; Supplier 1: LCSC; RoHS: Yes; Category: Chip SMD Resistors; Stock 1: 10645; Pricing 1: 5=0.07370, 50=0.05930, 150=0.05210, 500=0.04670, 2500=0.04240, 5000=0.04020 (USD); Mount: Surface Mount; Case/Package: 0603; Number of Pins: 2; Case Code (Metric): 1608; Case Code (Imperial): 0603; Contact Plating: Tin; Min Operating Temperature: -55°C; Max Operating Temperature: 155°C; Resistance: 4.7kR; Tolerance: 0.1%; Packaging: Tape and Reel; Resistor Type: Thin Film; Temperature Coefficient: 25ppm/°C; Series: ERA-3A; Number of Terminations: 2; Power Rating: 100mW; Voltage Rating: 75V; Construction: Rectangular; Package Quantity: 5000; Termination: SMD/SMT; Resistance Tolerance: 0.1%; Technology: THIN FILM; Working Voltage: 75V; Length: 1.6mm; Width: 0.8mm; Height: 0.45mm; Depth: 0.8mm; Radiation Hardening: No; RoHS Compliant: Yes; Military Standard: Not; Lead Free: Lead Free; REACH SVHC: No SVHC; ComponentLink1URL: https://datasheet.ciiva.com/11808/0900766b80fe20f7-11808039.pdf?src-supplier=RSComponents; ComponentLink1Description: https://datasheet.ciiva.com/11808/0900766b80fe20f7-11808039.pdf?src-supplier=RSComponents; ComponentLink2URL: https://datasheet.ciiva.com/29183/451124-da-01-en-widerstand-0603-era-29183789.pdf?src-supplier=Conrad; ComponentLink2Description: https://datasheet.ciiva.com/29183/451124-da-01-en-widerstand-0603-era-29183789.pdf?src-supplier=Conrad; ComponentLink3URL: https://datasheet.ciiva.com/9116/aoa0000ce26-9116681.pdf?src-supplier=Avnet; ComponentLink3Description: https://datasheet.ciiva.com/9116/aoa0000ce26-9116681.pdf?src-supplier=Avnet; ComponentLink4URL: https://datasheet.ciiva.com/30078/54aoa0000ce26-30078815.pdf?src-supplier=Onlinecomponents.com; ComponentLink4Description: https://datasheet.ciiva.com/30078/54aoa0000ce26-30078815.pdf?src-supplier=Onlinecomponents.com; ComponentLink5URL: https://datasheet.ciiva.com/43455/485442-43455227.pdf?src-supplier=Farnell; ComponentLink5Description: https://datasheet.ciiva.com/43455/485442-43455227.pdf?src-supplier=Farnell; ComponentLink6URL: https://datasheet.ciiva.com/46422/485442-46422693.pdf?src-supplier=Element14; ComponentLink6Description: https://datasheet.ciiva.com/46422/485442-46422693.pdf?src-supplier=Element14; ComponentLink7URL: https://datasheet.ciiva.com/22781/485442-22781497.pdf?src-supplier=Farnell; ComponentLink7Description: https://datasheet.ciiva.com/22781/485442-22781497.pdf?src-supplier=Farnell; ComponentLink8URL: https://datasheet.ciiva.com/48425/era-eng-tds-48425470.pdf?src-supplier=Distrelec; ComponentLink8Description: https://datasheet.ciiva.com/48425/era-eng-tds-48425470.pdf?src-supplier=Distrelec; ComponentLink9URL: https://datasheet.ciiva.com/22743/485442-22743061.pdf?src-supplier=Element14; ComponentLink9Description: https://datasheet.ciiva.com/22743/485442-22743061.pdf?src-supplier=Element14; ComponentLink10URL: https://datasheet.ciiva.com/16772/70068849-16772572.pdf?src-supplier=Allied+Electronics; ComponentLink10Description: https://datasheet.ciiva.com/16772/70068849-16772572.pdf?src-supplier=Allied+Electronics; ComponentLink11URL: https://datasheet.ciiva.com/9117/aoa0000ce26-9117707.pdf?src-supplier=Avnet; ComponentLink11Description: https://datasheet.ciiva.com/9117/aoa0000ce26-9117707.pdf?src-supplier=Avnet; Supplier Part Number 1: C473239
R11-R15 = RES 0603 1k 1%: Res Thick Film 0603 1K Ohm 1% 1/10W ±100ppm/°C Molded SMD Punched Carrier T/R; Manufacturer: Panasonic; Manufacturer Part Number: ERJ3EKF1001V; Power Rating: 100mW; Voltage Rating: 75V; Supplier 1: LCSC; RoHS: Yes; Category: Chip SMD Resistors; Stock 1: 79650; Pricing 1: 50=0.009600, 500=0.008100, 1500=0.007300, 5000=0.006800, 25000=0.006400, 50000=0.006200 (AUD); Mount: Surface Mount; Case/Package: 0603; Number of Pins: 2; Case Code (Metric): 1608; Case Code (Imperial): 0603; Contact Plating: Tin; Size Code: 0603; Min Operating Temperature: -55°C; Max Operating Temperature: 155°C; Packaging: Tape and Reel; Resistance: 1kR; Resistor Type: Thick Film; Temperature Coefficient: 100ppm/°C; Series: ERJ; Tolerance: 1%; Number of Terminations: 2; Max Power Dissipation: 100mW; Construction: Rectangular; Features: Automotive AEC-Q200; Package Quantity: 5000; Termination: SMD/SMT; Voltage Rating (DC): 75V; Resistance Tolerance: 1%; Technology: THICK FILM; Length: 1.6mm; Width: 0.8mm; Height: 0.45mm; Depth: 0.8mm; Radiation Hardening: No; RoHS Compliant: Yes; Lead Free: Lead Free; Military Standard: Not; REACH SVHC: No SVHC; ComponentLink1URL: https://datasheet.ciiva.com/7942/aoa0000ce2-7942427.pdf?src-supplier=Element14; ComponentLink1Description: https://datasheet.ciiva.com/7942/aoa0000ce2-7942427.pdf?src-supplier=Element14; ComponentLink2URL: https://datasheet.ciiva.com/46373/1678782-46373340.pdf?src-supplier=Element14; ComponentLink2Description: https://datasheet.ciiva.com/46373/1678782-46373340.pdf?src-supplier=Element14; ComponentLink3URL: https://datasheet.ciiva.com/22673/1678782-22673918.pdf?src-supplier=Element14; ComponentLink3Description: https://datasheet.ciiva.com/22673/1678782-22673918.pdf?src-supplier=Element14; ComponentLink4URL: https://datasheet.ciiva.com/46373/1678782-46373339.pdf?src-supplier=Element14; ComponentLink4Description: https://datasheet.ciiva.com/46373/1678782-46373339.pdf?src-supplier=Element14; ComponentLink5URL: https://datasheet.ciiva.com/24070/aoa0000ce2-24070269.pdf?src-supplier=Mouser; ComponentLink5Description: https://datasheet.ciiva.com/24070/aoa0000ce2-24070269.pdf?src-supplier=Mouser; ComponentLink6URL: https://datasheet.ciiva.com/16768/70260748-16768437.pdf?src-supplier=Allied+Electronics; ComponentLink6Description: https://datasheet.ciiva.com/16768/70260748-16768437.pdf?src-supplier=Allied+Electronics; ComponentLink7URL: https://datasheet.ciiva.com/16774/70260748-16774550.pdf?src-supplier=Allied+Electronics; ComponentLink7Description: https://datasheet.ciiva.com/16774/70260748-16774550.pdf?src-supplier=Allied+Electronics; ComponentLink8URL: https://datasheet.ciiva.com/9198/aoa0000ce2-9198923.pdf?src-supplier=Avnet; ComponentLink8Description: https://datasheet.ciiva.com/9198/aoa0000ce2-9198923.pdf?src-supplier=Avnet; ComponentLink9URL: https://datasheet.ciiva.com/16449/aoa0000ce2-16449065.pdf?src-supplier=Future+Electronics; ComponentLink9Description: https://datasheet.ciiva.com/16449/aoa0000ce2-16449065.pdf?src-supplier=Future+Electronics; ComponentLink10URL: https://datasheet.ciiva.com/48530/aoa0000ce2-48530987.pdf?src-supplier=Avnet; ComponentLink10Description: https://datasheet.ciiva.com/48530/aoa0000ce2-48530987.pdf?src-supplier=Avnet; ComponentLink11URL: https://datasheet.ciiva.com/30063/aoa0000ce2-30063390.pdf?src-supplier=Onlinecomponents.com; ComponentLink11Description: https://datasheet.ciiva.com/30063/aoa0000ce2-30063390.pdf?src-supplier=Onlinecomponents.com; Supplier Part Number 1: C118155
R18 R19 = RES 0603 560m 5%: 250mW Thick Film Resistors ±5% ±300ppm/℃ 560mΩ 0603 Chip Resistor - Surface Mount ROHS; Manufacturer: Panasonic; Manufacturer Part Number: ERJ-3BQJR56V; Tolerance: 5%; RoHS: Yes; Category: Chip SMD Resistors; Mount: Surface Mount; Case/Package: 0603; Resistance: 560m; Resistor Type: Thick Film; Number of Terminations: 2; Series: ERJ; Supplier: LCSC; Supplier Part Number: C2087100; Value: 560m
SB1 SB2 = TS-1187A-B-A-B: No NO 50mA 5.1mm 100mΩ 100000 160gf 12V -30℃~+85℃ 5.1mm 1.5mm Golden Round Button Brick nogging SPST SMD Tactile Switches ROHS; Manufacturer: *; Part Number: *; Supplier: *; Supplier part number: *; Supplier 1: LCSC; Supplier Part Number 1: C318884; Manufacturer Part Number: TS-1187A-B-A-B; RoHS: No; Category: Uncategorized; Stock 1: 372850; Pricing 1: 50=0.01550, 500=0.01200, 1500=0.01040, 4000=0.00920, 24000=0.00870, 48000=0.00840 (USD)
SW1 = SS12D07VG4: Vertical plug 500mA SPDT 50V 5000次 Plugin Slide Switches ROHS; Manufacturer: SHOU HAN; Manufacturer Part Number: SS12D07VG4 087; Supplier 1: LCSC; Supplier Part Number: C2939726
U1 = AMS1117_5V: Manufacturer: Advanced Monolithic Systems; Voltage max: 15V; Current max: 10mA; Operating temperature: 0°C ~ 125°C; HelpURL: https://forum.digikey.com/t/cross-reference-for-ams1117-3-3/4397
U2 = AMS1117: Manufacturer: Advanced Monolithic Systems; Voltage max: 15V; Current max: 10mA; Operating temperature: 0°C ~ 125°C; HelpURL: https://forum.digikey.com/t/cross-reference-for-ams1117-3-3/4397
U3 U4 = DRV8874PWPR: 40-V, 6-A H-bridge motor driver with integrated current sensing feedback 16-HTSSOP -40 to 125; Manufacturer: Texas Instruments; Supplier: LCSC; Supplier Part Number: C1855818; Manufacturer Part Number: DRV8874PWPR; RoHS: Yes; Category: Integrated Circuits (ICs); Stock: 4498; Pricing: 1=3.39, 10=3.043, 25=2.8768, 100=2.4934, 250=2.36552, 500=2.12258, 1000=1.79012 (USD); ComponentLink1URL: http://www.ti.com/general/docs/suppproductinfo.tsp?distId=10&amp;gotoUrl=http%3A%2F%2Fwww.ti.com%2Flit%2Fgpn%2Fdrv8874&src-supplier=Digi-Key; ComponentLink1Description: http://www.ti.com/general/docs/suppproductinfo.tsp?distId=10&amp;gotoUrl=http%3A%2F%2Fwww.ti.com%2Flit%2Fgpn%2Fdrv8874&src-supplier=Digi-Key
U5 = DS1307ZM/TR: SOP-8 Real-time Clocks (RTC) ROHS; Manufacturer: HGSEMI; Manufacturer Part Number: DS1307ZM/TR; Supplier Part Number: C910864; Supplier: LCSC; Package: SOP-8
U6 = CH340G: Transceiver 2Mbps USB 2.0 SOP-16-150mil USB ICs ROHS; Manufacturer: WCH(Jiangsu Qin Heng); Part Numbr: CH340G; Supplier: LCSC; Supplier Part Number: C14267; ComponentLink1Description: link; ComponentLink1URL: https://www.lcsc.com/product-detail/USB-ICs_WCH-Jiangsu-Qin-Heng-CH340G_C14267.html
U7 = ESP32-WROOM-32: Module; Manufacturer: Espressif Systems; Manufacturer Part Number: ESP32-WROOM-32E-N16; Supplier 1: LCSC; RoHS: No; Category: Uncategorized; Stock 1: 21973; Pricing 1: 1=3.60000 (USD); Supplier Part Number 1: C701343
Y1 = ABS25-32.768KHZ-T: CRYSTAL 32.7680KHZ 12.5PF SMD; ESR (Equivalent Series Resistance): 50kR; Tolerance: 20ppm; Width: 3.8mm; REACH SVHC: No SVHC; Load Capacitance: 12.5pF; Case/Package: SMD/SMT; Radiation Hardening: No; Series: ABS25; Number of Pins: 4; Mount: Surface Mount; RoHS Compliant: Yes; Packaging: Tape and Reel; Termination: SMD/SMT; Frequency Tolerance: 20ppm; Lead Free: Lead Free; Package Quantity: 1000; Min Operating Temperature: -40°C; Height: 0.098inch; Length: 8mm; Frequency: 32.768kHz; Max Operating Temperature: 85°C; Series Resistance: 50kR; Operating Frequency: 32.768 kHz; Depth: 3.8mm
Y2 = X49SD12MSD2SC: HC-49S 12MHz 20pF ±20ppm -20°C~70°C; Manufacturer: YXC; Supplier 1: LCSC; Supplier Part Number 1: C16369; Manufacturer Part Number: X49SD12MSD2SC; RoHS: No; Stock 1: 99265; Pricing 1: 5=0.06710, 50=0.05410, 150=0.04750, 500=0.04260, 2500=0.03870, 5000=0.03680 (USD)